# EasyEDA Pro project STM32空调遥控器.eprj, board PCB_V0.0.0
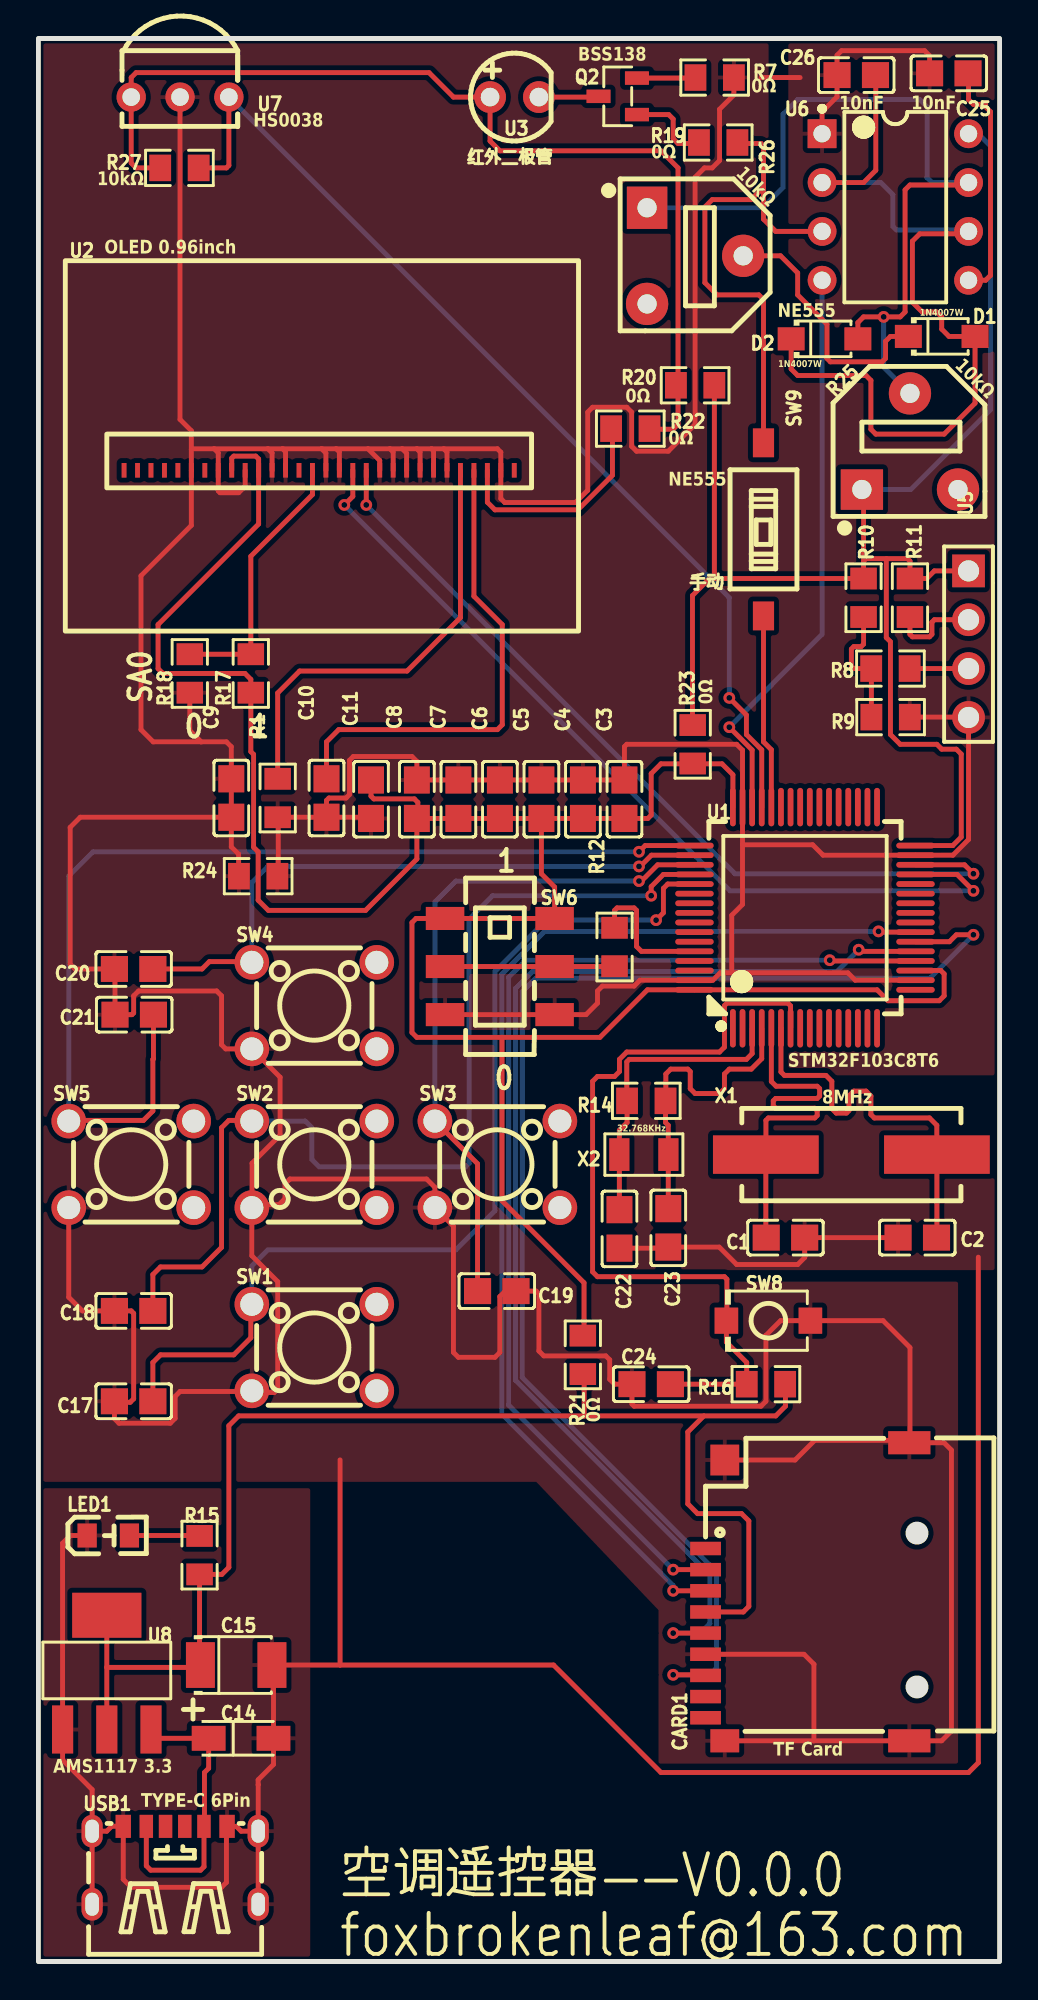
[diagram p1: board, top side]
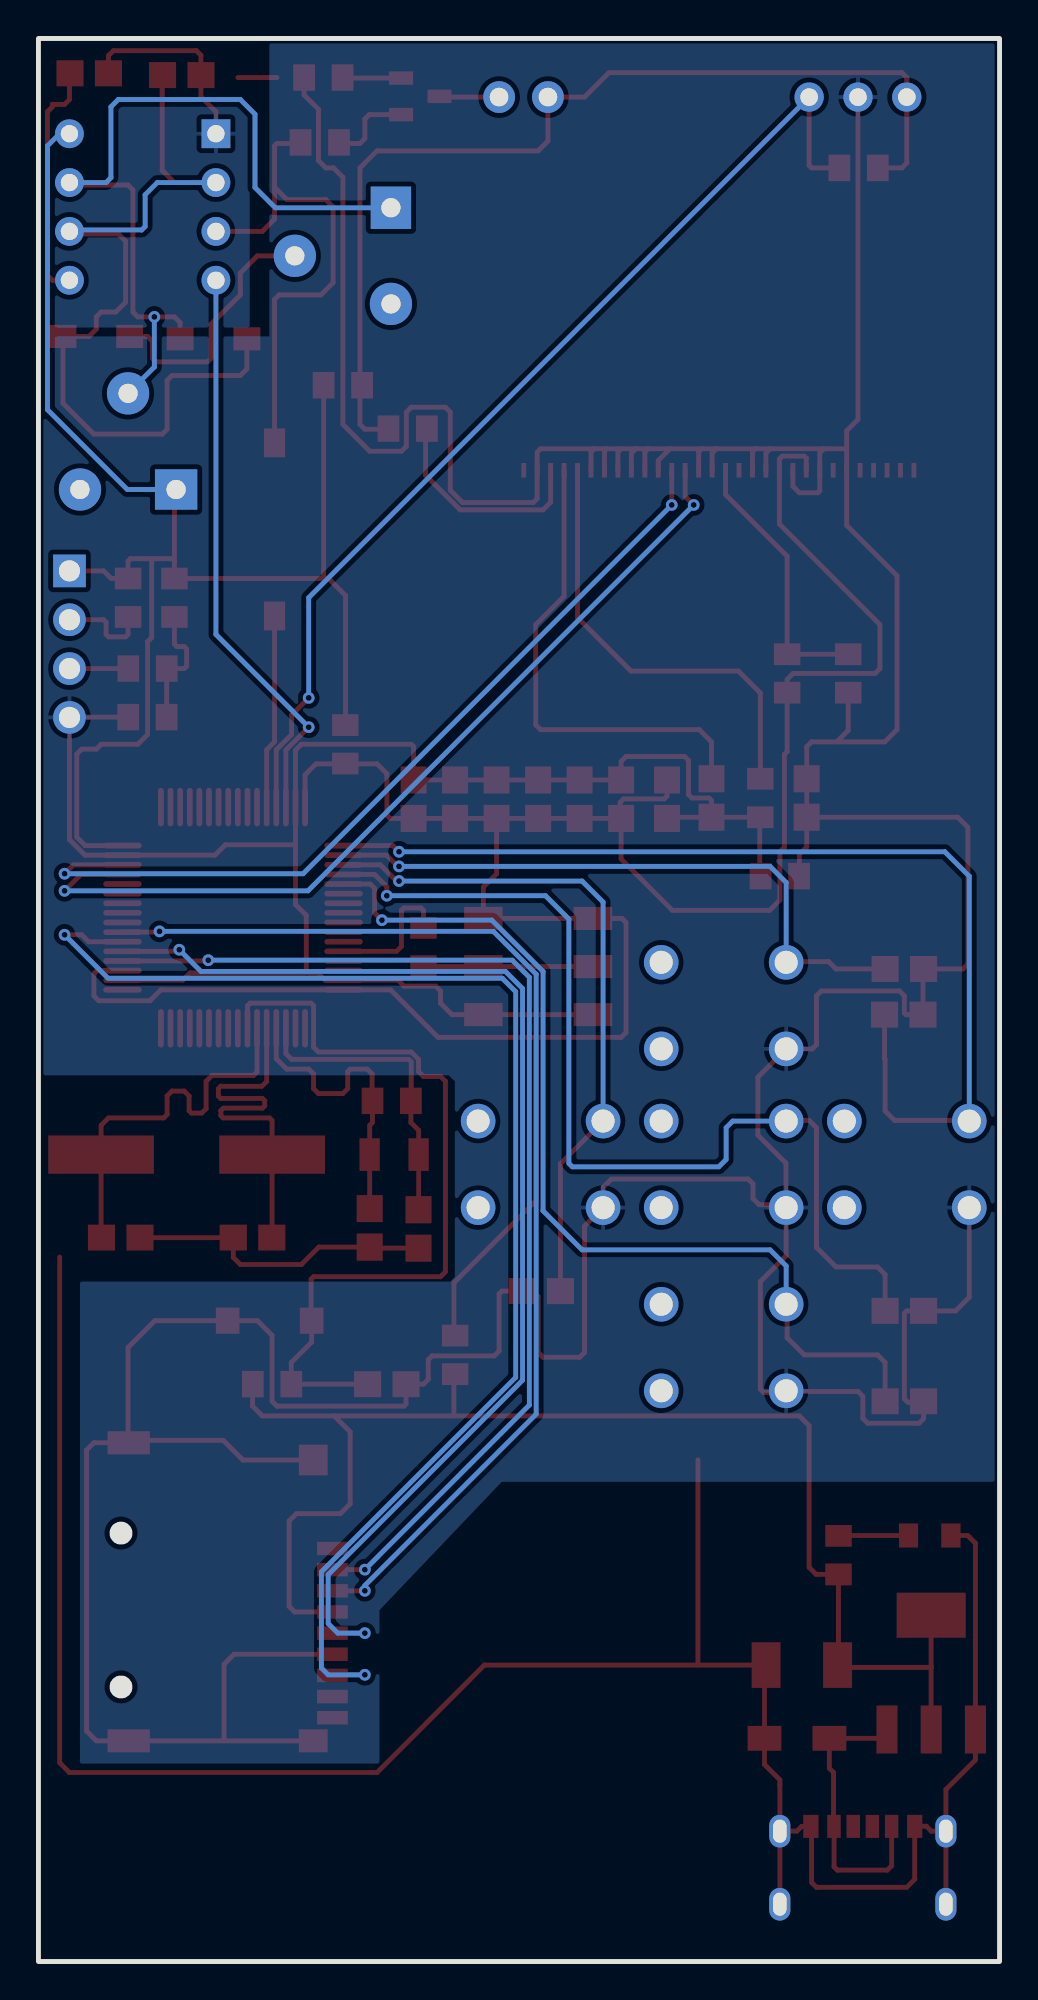
[diagram p2: board, bottom side, seen from below]

Outline 50 x 100 mm; copper layers: Top Layer, Bottom Layer. Coordinates in mm from the lower left corner of the outline.
Outline path: rectangle 0,100 50,0
Stack: Top Layer 0.035mm / Dielectric1 1.51mm FR4 er 4.5 / Bottom Layer 0.035mm

## Design rules (mm)
net OSC_IN: OSC
net OSC_OUT: OSC
net OSC32_IN: OSC32
net OSC32_OUT: OSC32
template: JLCPCB Capability(Two Layers Board)
spacing copperThickness1oz (default): track to track 0.102, other pairs 0.152 to 0.3
spacing copperThickness2oz: track to track 0.203, other pairs 0.152 to 0.3
track width copperThickness1oz (default): min 0.127, default 0.254, max 2.54
track width copperThickness2oz: min 0.203, default 0.254, max 2.54
differential pair differentialPair (default): width min 0.127, default 0.254, max 2.54; gap min 0.152, default 0.152
via viaSize (default): diameter min 0.5, default 0.61, max 10; hole min 0.3, default 0.305, max 6.3

## Placement (name value [footprint] x y rotation side)
C1  20pF  [C0805]  38.86 37.64 180 top
C2  20pF  [C0805]  45.72 37.64 0 top
C3  100nF  [C0805]  30.49 60.44 270 top
C4  100nF  [C0805]  28.33 60.44 270 top
C5  100nF  [C0805]  26.17 60.44 270 top
C6  100nF  [C0805]  24.01 60.44 270 top
C7  100nF  [C0805]  21.85 60.44 270 top
C8  4.7uF  [C0805]  19.69 60.44 270 top
C9  1uF  [C0805]  10.03 60.5 90 top
C10  2.2uF  [C0805]  14.99 60.5 270 top
C11  2.2uF  [C0805]  17.3 60.44 270 top
C14  10uF  [CAP-SMD_L3.2-W1.6-RD-C7171]  10.54 11.61 0 top
C15  22uF  [CASE-B_3528]  10.29 15.42 0 top
C17  100uF  [C0805]  4.95 29.13 0 top
C18  100uF  [C0805]  4.95 33.83 0 top
C19  100uF  [C0805]  23.84 34.86 180 top
C20  100uF  [C0805]  4.95 51.61 0 top
C21  100uF  [C0805]  4.98 49.24 0 top
C22  12.5pF  [C0805]  30.23 38.1 90 top
C23  12.5pF  [C0805]  32.77 38.15 90 top
C24  100nF  [C0805]  31.88 30.02 0 top
C25  0.01μF  [C0805]  47.36 98.19 0 top
C26  10nF  [C0805]  42.54 98.09 0 top
CARD1  TF PUSH  [TF-SMD_TF-PUSH]  40 19.23 90 top
D1  1N4007W  [SOD-123FL_L2.7-W1.8-LS3.8-RD]  46.99 84.51 0 top
D2  1N4007W  [SOD-123FL_L2.7-W1.8-LS3.8-RD]  40.89 84.38 0 top
LED1  -  [LED_0805]  3.68 22.15 0 top
Q2  BSS138  [SOT-23-3_L2.9-W1.3-P1.90-LS2.4-BR]  30.14 96.99 0 top
R1  64K  [R0805]  12.45 60.5 270 top
R7  165  [R0805]  35.18 97.97 180 top
R8  10K  [R0805]  44.32 67.23 180 top
R9  0  [R0805]  44.33 64.71 0 top
R10  0  [R0805]  42.93 70.92 90 top
R11  10K  [R0805]  45.34 70.92 90 top
R12  10K  [R0805]  29.97 52.76 270 top
R14  1M  [R0805]  31.62 44.75 180 top
R15  1.3K  [R0805]  8.38 21.13 270 top
R16  10K  [R0805]  37.85 30.02 0 top
R17  0  [R0805]  11.05 66.98 90 top
R18  0  [R0805]  7.87 66.98 90 top
R19  0  [R0805]  35.36 94.59 0 top
R20  0  [R0805]  34.16 81.97 0 top
R21  0  [R0805]  28.32 31.55 90 top
R22  0  [R0805]  30.79 79.71 0 top
R23  0  [R0805]  34.04 63.3 90 top
R24  0  [R0805]  11.43 56.44 0 top
R25  10kΩ  [RES-ADJ-SMD_RM065-V1]  45.34 79.05 0 top
R26  10kΩ  [RES-ADJ-SMD_RM065-V1]  34.16 88.7 270 top
R27  10K  [R0805]  7.33 93.27 180 top
SW1  KH-6X6X5H-TJ  [SW-TH_4P-L6.0-W6.0-P4.50-LS6.5]  14.35 31.93 0 top
SW2  KH-6X6X5H-TJ  [SW-TH_4P-L6.0-W6.0-P4.50-LS6.5]  14.35 41.45 0 top
SW3  KH-6X6X5H-TJ  [SW-TH_4P-L6.0-W6.0-P4.50-LS6.5]  23.88 41.45 0 top
SW4  KH-6X6X5H-TJ  [SW-TH_4P-L6.0-W6.0-P4.50-LS6.5]  14.35 49.71 0 top
SW5  KH-6X6X5H-TJ  [SW-TH_4P-L6.0-W6.0-P4.50-LS6.5]  4.83 41.45 0 top
SW6  MST22D18G2 125  [SW-SMD_MST22D18G2]  24 51.74 270 top
SW8  TS-1088-AR02016  [SW-SMD_L3.9-W3.0-P4.45]  37.97 33.33 180 top
SW9  DSIC01LS-P  [SW-SMD_2P-L3.5-W6.2-P2.54-LS9.8]  37.72 74.47 270 top
U1  STM32F103RCT6  [LQFP-64_L10.0-W10.0-P0.50-LS12.0-BL]  39.88 54.28 0 top
U2  -  [30pin_SSD1306]  1.4 88.44 0 top
U3  MHL312IR039CRT  [LED-TH_BD4.2-P2.54-FD]  24.76 96.95 0 top
U5  2.54-1*4  [HDR-TH_4P-P2.54-V-M-1]  48.39 68.5 270 top
U6  NE555N  [DIP-8_L9.8-W6.6-P2.54-LS7.6-BL]  44.58 91.24 270 top
U7  HS0038BD  [OPTO-TH_3P-L6.0-W5.6-P2.54_TSOP14656]  7.37 96.95 180 top
U8  AMS1117-3.3  [SOT-223-3_L6.5-W3.4-P2.30-LS7.0-BR]  3.56 15.04 270 top
USB1  TYPE-C 6P(073)  [TYPE-C-SMD_TYPE-C-6P_5]  7.11 5 0 top
X1  8MHz  [CRYSTAL-SMD_L11.5-W4.8-LS12.7]  42.29 41.96 0 top
X2  32.768kHz  [OSC-SMD_L3.2-W1.5]  31.5 41.96 180 top

## Footprints (pads in the part's own frame, mm; a bottom-side part is the same pattern mirrored in y, then rotated)
30pin_SSD1306
  custom 0.254x0.762 smd: 1(3.058,-10.899) 2(3.757,-10.899) 3(4.457,-10.899) 4(5.157,-10.899) 5(5.857,-10.899) 6(6.558,-10.899) 7(7.258,-10.899) 8(7.957,-10.899) 9(8.658,-10.899) 10(9.357,-10.899) 11(10.057,-10.899) 12(10.758,-10.899) 13(11.457,-10.899) 14(12.158,-10.899) 15(12.857,-10.899) 16(13.557,-10.899) 17(14.258,-10.899) 18(14.957,-10.899) 19(15.658,-10.899) 20(16.358,-10.899) 21(17.058,-10.899) 22(17.758,-10.899) 23(18.457,-10.899) 24(19.157,-10.899) 25(19.858,-10.899) 26(20.558,-10.899) 27(21.258,-10.899) 28(21.957,-10.899) 29(22.657,-10.899) 30(23.358,-10.899)
C0805
  rect 1.41x1.35 smd: 1(-1,0) 2(1,0)
CAP-SMD_L3.2-W1.6-RD-C7171
  rect 1.758x1.296 smd: 1(-1.687,0) 2(1.687,0)
CASE-B_3528
  rect 1.506x2.376 smd: 1(-1.861,0) 2(1.861,0)
CRYSTAL-SMD_L11.5-W4.8-LS12.7
  rect 5.5x2 smd: 1(-4.45,0) 2(4.45,0)
DIP-8_L9.8-W6.6-P2.54-LS7.6-BL
  rect 1.5x1.5 hole 0.9: 1(-3.81,-3.81)
  round 1.5 hole 0.9: 2(-1.27,-3.81) 3(1.27,-3.81) 4(3.81,-3.81) 5(3.81,3.81) 6(1.27,3.81) 7(-1.27,3.81) 8(-3.81,3.81)
HDR-TH_4P-P2.54-V-M-1
  rect 1.7x1.7 hole 1.1: 1(-3.81,0)
  round 1.7 hole 1.1: 2(-1.27,0) 3(1.27,0) 4(3.81,0)
LED-TH_BD4.2-P2.54-FD
  round 1.651 hole 0.965: 1(-1.27,0) 2(1.27,0)
LED_0805
  rect 1x1.25 smd: 1(-1.15,0.005) 2(1.05,0.005)
LQFP-64_L10.0-W10.0-P0.50-LS12.0-BL
  oval 0.3x2 smd: 1(-3.75,-5.75) 2(-3.25,-5.75) 3(-2.75,-5.75) 4(-2.25,-5.75) 5(-1.75,-5.75) 6(-1.25,-5.75) 7(-0.75,-5.75) 8(-0.25,-5.75) 9(0.25,-5.75) 10(0.75,-5.75) 11(1.25,-5.75) 12(1.75,-5.75) 13(2.25,-5.75) 14(2.75,-5.75) 15(3.25,-5.75) 16(3.75,-5.75) 33(3.75,5.75) 34(3.25,5.75) 35(2.75,5.75) 36(2.25,5.75) 37(1.75,5.75) 38(1.25,5.75) 39(0.75,5.75) 40(0.25,5.75) 41(-0.25,5.75) 42(-0.75,5.75) 43(-1.25,5.75) 44(-1.75,5.75) 45(-2.25,5.75) 46(-2.75,5.75) 47(-3.25,5.75) 48(-3.75,5.75)
  oval 2x0.3 smd: 17(5.75,-3.75) 18(5.75,-3.25) 19(5.75,-2.75) 20(5.75,-2.25) 21(5.75,-1.75) 22(5.75,-1.25) 23(5.75,-0.75) 24(5.75,-0.25) 25(5.75,0.25) 26(5.75,0.75) 27(5.75,1.25) 28(5.75,1.75) 29(5.75,2.25) 30(5.75,2.75) 31(5.75,3.25) 32(5.75,3.75) 49(-5.75,3.75) 50(-5.75,3.25) 51(-5.75,2.75) 52(-5.75,2.25) 53(-5.75,1.75) 54(-5.75,1.25) 55(-5.75,0.75) 56(-5.75,0.25) 57(-5.75,-0.25) 58(-5.75,-0.75) 59(-5.75,-1.25) 60(-5.75,-1.75) 61(-5.75,-2.25) 62(-5.75,-2.75) 63(-5.75,-3.25) 64(-5.75,-3.75)
OPTO-TH_3P-L6.0-W5.6-P2.54_TSOP14656
  round 1.524 hole 0.914: 1(-2.54,0) 2(0,0) 3(2.54,0)
OSC-SMD_L3.2-W1.5
  rect 1.05x1.7 smd: 1(-1.275,0) 2(1.275,0)
R0805
  rect 1.133x1.377 smd: 1(-1,0) 2(1,0)
RES-ADJ-SMD_RM065-V1
  rect 2.2x2.1 hole 1: 1(-2.5,-2.5)
  round 2.2 hole 1: 2(0,2.5) 3(2.5,-2.5)
SOD-123FL_L2.7-W1.8-LS3.8-RD
  rect 1.4x1.2 smd: 1(-1.735,0) 2(1.735,0)
SOT-23-3_L2.9-W1.3-P1.90-LS2.4-BR
  rect 1.25x0.7 smd: 1(1,-0.95) 2(1,0.95) 3(-1,0)
SOT-223-3_L6.5-W3.4-P2.30-LS7.0-BR
  rect 2.5x1.1 smd: 1(2.97,-2.3) 2(2.97,0) 3(2.97,2.3)
  rect 2.34x3.6 smd: 4(-2.97,0)
SW-SMD_2P-L3.5-W6.2-P2.54-LS9.8
  rect 1.5x1.1 smd: 1(-4.5,0) 2(4.5,0)
SW-SMD_L3.9-W3.0-P4.45
  rect 1.23x1.36 smd: 1(-2.185,0) 2(2.185,0)
SW-SMD_MST22D18G2
  rect 1.2x2 smd: 1(-2.5,2.85) 2(0,2.85) 3(2.5,2.85) 4(-2.5,-2.85) 5(0,-2.85) 6(2.5,-2.85)
SW-TH_4P-L6.0-W6.0-P4.50-LS6.5
  round 1.8 hole 1.2: 1(-3.25,2.25) 2(3.25,2.25) 3(-3.25,-2.25) 4(3.25,-2.25)
TF-SMD_TF-PUSH
  rect 0.7x1.6 smd: 1(2.25,5.3) 2(1.15,5.3) 3(0.05,5.3) 4(-1.05,5.3) 5(-2.15,5.3) 6(-3.25,5.3) 7(-4.35,5.3) 8(-5.45,5.3) CD(-6.55,5.3)
  rect 1.2x1.5 smd: 10(-7.75,4.3)
  rect 1.2x2.2 smd: 11(-7.75,-5.3) 12(7.75,-5.3)
  rect 1.6x1.5 smd: 13(6.85,4.3)
TYPE-C-SMD_TYPE-C-6P_5
  oval 1.1x1.7 hole 0.7x1.2: 7(-4.32,1.775) 7(-4.32,-2.025) 7(4.32,1.775) 7(4.32,-2.025)
  rect 0.7x1.2 smd: A5(-0.5,2.025) A9(1.5,2.025) B5(0.5,2.025) B9(-1.5,2.025)
  rect 0.8x1.2 smd: A12(2.7,2.025) B12(-2.7,2.025)

## Nets
+5V: C14.1 U8.3 USB1.A9 USB1.B9
GND: C1.1 C2.1 C3.1 C4.1 C5.1 C6.1 C7.1 C8.1 C9.1 C9.2 C10.2 C11.2 C14.2 C15.2 C17.1 C18.1 C19.1 C20.1 C21.1 C22.1 C23.1 C24.1 C25.1 C26.1 CARD1.6 CARD1.10 CARD1.11 CARD1.12 CARD1.13 LED1.1 R1.2 R7.1 R9.2 R18.1 R24.1 R24.2 SW1.3 SW2.3 SW3.3 SW4.3 SW5.3 SW6.3 SW6.6 SW8.1 U1.18 U1.31 U1.47 U1.63 U2.6 U2.8 U2.10 U2.12 U2.13 U2.16 U2.17 U2.20 U2.21 U2.22 U2.23 U2.24 U2.25 U2.29 U5.4 U6.1 U7.2 U8.1 USB1.7 USB1.A12 USB1.B12
VCC: C3.2 C4.2 C5.2 C6.2 C7.2 C8.2 C11.1 C15.1 CARD1.4 R10.2 R11.2 R15.2 R16.2 R17.1 R20.1 R20.2 R21.1 R21.2 R22.1 R22.2 R23.1 R23.2 R25.1 R27.2 SW6.1 SW6.4 U1.19 U1.32 U1.48 U1.64 U2.9 U2.11 U2.28 U3.1 U5.1 U6.8 U7.3 U8.2 U8.4
BOOT0: R12.1 U1.60
IR_CTL: U1.46 U6.4
IR_IN: R27.1 U1.45 U7.1
IR_OUT: Q2.1 R19.1 R19.2 SW9.1 U6.3
KEY_1: C17.2 SW1.1 U1.53
KEY_2: C18.2 SW2.1 U1.52
KEY_3: C19.2 SW3.1 U1.51
KEY_4: C20.2 SW4.1 U1.50
KEY_5: C21.2 SW5.1 U1.49
NRST: C24.2 R16.1 SW8.2 U1.7
OLED_SCL: U1.29 U2.18
OLED_SDA: U1.30 U2.19
OSC32_IN: C22.2 R14.2 U1.3 X2.2
OSC32_OUT: C23.2 R14.1 U1.4 X2.1
OSC_IN: C1.2 U1.5 X1.1
OSC_OUT: C2.2 U1.6 X1.2
SPI_CLK: CARD1.5 U1.21
SPI_CS: CARD1.2 U1.20
SPI_DI: CARD1.3 U1.23
SPI_DO: CARD1.7 U1.22
SWCLK: R8.1 U5.3
SWDIO: R11.1 U5.2
$1N1778: R1.1 U2.26
$1N2024: C10.1 U2.27
$1N5193: Q2.3 U3.2
$1N5313: Q2.2 R7.2
$1N5687: R8.2 R9.1 R10.1
$1N5950: R12.2 SW6.2 SW6.5
$1N6331: LED1.2 R15.1
$1N7000: R17.2 R18.2 U2.15
$1N7313: SW9.2 U1.44
$1N7750: C25.2 U6.5
$1N7809: C26.2 D1.2 D2.1 U6.2 U6.6
$1N7888: D2.2 R25.2 R26.1 U6.7
$1N9996: D1.1 R26.2

Pads without a net: CARD1 1 8 CD; R25 3; R26 3; SW1 2 4; SW2 2 4; SW3 2 4; SW4 2 4; SW5 2 4; U1 1 2 8 9 10 11 12 13 14 15 16 17 24 25 26 27 28 33 34 35 36 37 38 39 40 41 42 43 54 55 56 57 58 59 61 62; U2 1 2 3 4 5 7 14 30; USB1 A5 B5

## Via types
v1: diameter 0.61, hole 0.305, Top Layer to Bottom Layer, 20 vias

## Routing (per net, layer and track width the routed paths; a pad name or vN(x,y) marks a point on that pad's centre or on a via; arc(x,y) is an arc through that point)
+5V: length 15.2
  Top Layer w0.254: U8.3 6.31,11.61 C14.1 8.85,10.05 8.64,9.83 8.64,7.05 USB1.A9 8.61,4.93 8.43,4.75 5.84,4.75 5.61,4.98 USB1.B9
GND: length 554.8
  Top Layer w0.254: 11.06,29.64 11.12,29.59 12.27,29.59 12.45,29.77 12.45,35.36 11.1,36.7 SW2.3 11.11,39.21 11.11,39.36 ; 11.06,29.64 SW1.3 ; 11.06,29.64 7.37,29.64 7.11,29.39 7.11,28.25 6.86,27.99 4.19,27.99 3.95,28.23 C17.1 4.01,29.08 4.77,29.08 4.95,29.26 4.95,33.71 4.83,33.83 C18.1 2.29,33.83 1.58,34.54 SW5.3 ; CARD1.12 45.34,27.01 45.34,31.93 43.94,33.33 SW8.1 38.61,33.33 37.85,32.56 37.85,29.13 37.59,28.88 30.99,28.88 30.88,28.99 C24.1 29.97,30.02 29.72,30.28 29.72,31.29 29.52,31.49 26.29,31.49 26.03,31.75 26.03,34.72 25.89,34.86 C19.1 24.28,34.86 24,34.58 24,31.67 23.75,31.42 21.84,31.42 21.59,31.67 21.59,38.24 SW3.3 20.63,40.26 20.19,40.69 13.08,40.69 12.83,40.44 12.83,39.67 12.51,39.36 11.11,39.36 ; CARD1.12 47.11,26.98 47.5,26.59 47.5,11.99 46.99,11.48 CARD1.11 40.34,11.48 ; CARD1.12 45.18,27.1 40.39,27.1 39.36,26.08 CARD1.13 ; 18.92,78.66 19.15,78.43 U2.22 ; 18.92,78.66 19.69,78.66 ; 18.92,78.66 18.29,78.66 ; 11.11,39.36 11.11,41.52 12.57,42.98 12.57,45.99 SW4.3 9.74,47.46 9.53,47.68 9.53,50.22 9.27,50.47 5.21,50.47 4.95,50.22 4.95,49.33 4.86,49.24 C21.1 3.98,51.58 C20.1 1.91,51.61 1.65,51.87 1.65,58.98 2.17,59.5 C9.1 ; 17.15,78.66 15.49,78.66 ; 17.15,78.66 17.75,78.05 U2.20 ; 17.15,78.66 18.29,78.66 ; 15.49,78.66 14.73,78.66 ; 15.49,78.66 15.65,78.5 U2.17 ; 36.07,51.43 36.07,54.41 36.63,54.97 36.63,58.07 ; 18.29,78.66 18.45,78.5 U2.21 ; 37.59,97.97 39.62,97.97 ; U2.23 19.85,78.49 19.69,78.66 ; 21.08,78.66 23.88,78.66 24.05,78.49 U2.29 24.05,76.07 24.26,75.87 27.94,75.87 28.57,76.5 28.57,80.57 28.83,80.82 30.61,80.82 30.86,80.57 30.86,78.79 31.12,78.54 32.77,78.54 34.16,79.93 34.16,92.79 34.65,93.27 35.05,93.27 35.43,93.65 35.43,96.32 36.18,97.06 R7.1 ; 21.08,78.66 21.25,78.49 U2.25 ; 21.08,78.66 20.45,78.66 ; R18.1 7.87,64.01 8.46,63.42 ; 14.73,78.66 12.7,78.66 ; 14.73,78.66 14.95,78.44 U2.16 ; 12.7,78.66 12.85,78.51 U2.13 ; 12.7,78.66 11.94,78.66 ; 19.69,78.66 20.45,78.66 ; C9.1 10.03,57.96 10.41,57.58 10.41,56.45 10.47,56.39 ; C9.1 C9.2 10.03,63.17 9.78,63.42 8.46,63.42 ; 7.95,78.62 U2.6 7.95,74.68 5.33,72.06 5.33,64.06 5.97,63.42 8.46,63.42 ; 7.95,78.62 7.95,79.6 7.37,80.19 U7.2 ; 7.95,78.62 7.99,78.66 9.14,78.66 ; 40.34,11.48 40.34,15.46 39.83,15.98 CARD1.6 ; 40.34,11.48 CARD1.10 ; C10.2 17.27,59.5 17.3,59.48 ; C10.2 R1.2 12.47,59.47 12.47,56.39 ; C10.2 14.99,60.38 15.11,60.5 16,60.5 16.18,60.68 16.18,62.46 16.38,62.66 19.43,62.66 19.69,62.41 C8.1 C7.1 C6.1 C5.1 C4.1 C3.1 30.49,63.17 30.61,63.3 36.32,63.3 36.63,62.99 U1.47 36.63,58.07 ; 20.45,78.66 20.55,78.56 U2.24 ; C22.1 32.71,37.1 C23.1 35.42,37.15 36.32,36.25 39.5,36.25 39.86,36.61 C1.1 C2.1 ; 11.43,2.98 USB1.7 ; USB1.7 10.54,6.78 10.29,7.03 USB1.A12 9.78,7 9.78,4.12 9.53,3.86 4.83,3.86 4.41,4.28 USB1.B12 4.41,7.04 3.81,7.04 3.55,6.78 USB1.7 ; USB1.7 11.43,9.19 11.43,9.19 11.43,9.45 12.23,10.25 C14.2 12.23,15.34 C15.2 15.69,15.42 ; USB1.7 2.79,2.98 ; USB1.7 2.79,6.78 2.79,8.94 1.26,10.48 U8.1 1.26,21.75 1.66,22.15 LED1.1 ; R9.2 48.37,64.71 U5.4 48.39,58.34 47.57,57.53 U1.31 40.82,57.53 40.28,58.07 36.63,58.07 ; 11.94,78.66 9.14,78.66 ; 11.94,78.66 12.15,78.45 U2.12 ; 9.14,78.66 9.35,78.45 U2.8 9.35,76.47 9.45,76.38 10.41,76.38 10.75,76.72 U2.10 ; 36.09,51.41 42.11,51.41 42.49,51.03 U1.18 ; C25.1 46.36,99.11 46.1,99.37 41.78,99.37 41.54,99.13 C26.1 41.54,96.97 40.77,96.19 U6.1 ; 48.9,36.63 48.9,10.34 48.39,9.83 32.38,9.83 26.8,15.42 15.69,15.42 ; SW6.6 SW6.3 28.49,49.24 29.08,49.83 29.08,50.47 29.34,50.72 30.99,50.72 31.29,51.03 U1.63 35.09,51.03 35.47,51.41 36.02,51.41 ; 15.69,15.42 15.69,26.09
VCC: length 354.6
  Top Layer w0.254: 28.39,28.37 28.39,30.49 28.38,30.49 ; 28.39,28.37 34.61,28.37 ; 28.39,28.37 10.41,28.37 9.91,27.86 9.91,20.5 9.54,20.13 R15.2 8.38,15.46 C15.1 8.3,15.29 3.56,15.29 ; R25.1 42.93,76.46 42.93,72.82 ; R27.2 5.08,93.27 4.83,93.52 U7.3 4.83,97.97 5.08,98.22 20.32,98.22 21.59,96.95 23.5,96.95 23.5,94.67 24,94.16 32.38,94.16 33.27,93.27 33.27,79.93 33.02,79.68 31.86,79.68 ; U1.32 47.56,58.03 48.01,58.47 48.01,62.79 47.75,63.04 46.99,63.04 46.74,63.3 44.83,63.3 44.32,63.81 44.32,68.63 44.11,68.84 44.11,72.95 ; 34.61,28.37 33.78,27.54 33.78,23.8 34.29,23.29 36.58,23.29 36.96,22.91 36.96,18.47 36.67,18.18 CARD1.4 ; 34.61,28.37 38.35,28.37 38.86,28.88 38.86,30.01 R16.2 ; U1.48 36.13,61.71 35.56,62.28 32.38,62.28 31.88,61.77 31.88,59.61 31.7,59.44 C3.2 C4.2 C5.2 ; U5.1 46.61,72.31 46.21,71.92 R11.2 45.34,72.82 45.21,72.95 44.11,72.95 ; U1.19 45.64,51.54 46.94,51.54 47.12,51.36 47.12,50.22 46.86,49.96 44.2,49.96 43.63,50.53 U1.64 31.68,50.53 29.21,48.06 24.12,48.06 ; C8.2 C7.2 C6.2 C5.2 ; C8.2 19.74,59.49 19.74,60.28 19.56,60.46 17.44,60.46 17.3,60.6 17.3,61.48 ; C8.2 19.69,57.33 17.02,54.66 11.96,54.66 11.43,55.19 11.43,57.71 11.19,57.95 11.19,62.77 11.05,62.92 R17.1 11.05,66.67 10.74,66.98 6.48,66.98 6.22,67.23 6.22,69.52 11.45,74.75 U2.11 11.45,78.13 11.3,78.28 10.16,78.28 10.05,78.18 U2.9 ; 29.86,79.68 29.86,77.29 28.06,75.49 23.75,75.49 23.35,75.88 U2.28 ; 3.56,15.29 U8.2 ; 3.56,15.29 U8.4 ; 24.12,48.06 24.12,39.56 28.38,35.3 28.38,32.49 ; 24.12,48.06 19.69,48.06 19.43,48.31 19.43,54.03 19.65,54.24 SW6.4 SW6.1 26.85,55.88 26.17,56.56 C5.2 ; 42.93,72.82 R10.2 35.16,71.92 ; 42.93,72.82 43.05,72.95 44.11,72.95 ; R20.2 35.16,71.92 35.16,71.92 ; 34.03,64.3 34.03,71.03 34.91,71.92 35.16,71.92
  Bottom Layer w0.254: R25.1 45.38,76.55 49.53,80.7 49.53,94.41 48.9,95.05 U6.8
BOOT0: length 7.1
  Top Layer w0.254: U1.60 31.37,52.53 31.12,52.78 31.12,54.66 30.99,54.79 30.1,54.79 29.97,54.66 R12.1
IR_CTL: length 29.9
  Top Layer w0.254: v1(35.94,64.19) 37.13,63 U1.46
  Bottom Layer w0.254: 40.77,87.43 40.77,69.01 v1(35.94,64.19)
IR_IN: length 53.6
  Top Layer w0.254: R27.1 9.78,93.27 9.91,93.4 U7.1 ; v1(35.94,65.71) 36.83,64.82 36.83,63.81 37.63,63.01 U1.45
  Bottom Layer w0.254: U7.1 35.94,70.92 v1(35.94,65.71)
IR_OUT: length 31.2
  Top Layer w0.254: SW9.1 37.72,86.42 37.48,86.67 35.31,86.67 34.67,87.3 34.67,91.24 35.05,91.62 37.07,91.62 37.72,92.26 ; 34.31,94.54 33.27,94.54 33.02,94.79 33.02,95.81 32.79,96.04 Q2.1 ; 37.72,92.26 37.72,94.41 37.59,94.54 36.31,94.54 ; 37.72,92.26 37.72,90.6 38.35,89.97 U6.3
KEY_1: length 50.7
  Top Layer w0.254: v1(32.13,54.15) 32.51,54.53 32.51,55.8 32.74,56.03 U1.53 ; C17.2 5.95,31.15 6.35,31.55 10.16,31.55 11.05,32.44 11.05,34.13 SW1.1
  Bottom Layer w0.254: v1(32.13,54.15) 26.42,54.15 23.75,51.49 23.75,39.04 21.72,37.01 11.94,37.01 11.1,36.17 SW1.1
KEY_2: length 53
  Top Layer w0.254: SW2.1 11.06,43.74 9.91,43.74 9.53,43.36 9.53,37.14 8.51,36.12 6.35,36.12 5.95,35.72 C18.2 ; v1(31.88,55.42) 31.88,55.89 32.51,56.53 U1.52
  Bottom Layer w0.254: SW2.1 13.88,43.7 14.22,43.36 14.22,41.71 14.6,41.33 22.22,41.33 22.4,41.51 22.4,54.21 23.62,55.42 v1(31.88,55.42)
KEY_3: length 35.5
  Top Layer w0.254: v1(31.24,56.19) 31.37,56.19 32.21,57.03 U1.51 ; C19.2 22.84,41.48 SW3.1
  Bottom Layer w0.254: SW3.1 20.63,55.09 21.72,56.19 v1(31.24,56.19)
KEY_4: length 33.1
  Top Layer w0.254: C20.2 8.51,51.61 8.89,51.99 11.06,51.99 SW4.1 ; U1.50 31.89,57.53 31.31,56.95 v1(31.24,56.95)
  Bottom Layer w0.254: v1(31.24,56.95) 11.94,56.95 11.1,56.11 SW4.1
KEY_5: length 55.6
  Top Layer w0.254: U1.49 31.56,58.03 v1(31.24,57.71) ; C21.2 5.98,46.94 5.95,46.91 5.95,44.23 5.46,43.74 1.61,43.74 SW5.1
  Bottom Layer w0.254: v1(31.24,57.71) 2.85,57.71 1.58,56.44 SW5.1
NRST: length 41.8
  Top Layer w0.254: U1.7 39.13,49.7 38.99,49.83 35.81,49.83 35.69,49.71 35.69,47.55 35.43,47.3 30.61,47.3 30.23,46.91 30.23,46.28 29.97,46.03 29.08,46.03 28.83,45.77 28.83,35.86 29.08,35.61 35.69,35.61 35.81,35.48 35.81,33.35 SW8.2 35.79,32.21 36.85,31.15 R16.1 C24.2
OLED_SCL: length 46.4
  Top Layer w0.254: U2.18 16.35,76.19 v1(15.91,75.74) ; v1(48.64,55.68) 47.79,56.53 U1.29
  Bottom Layer w0.254: v1(48.64,55.68) 35.98,55.68 v1(15.91,75.74)
OLED_SDA: length 44.5
  Top Layer w0.254: U1.30 48.18,57.03 v1(48.64,56.57) ; U2.19 v1(17.05,75.74)
  Bottom Layer w0.254: v1(17.05,75.74) 36.23,56.57 v1(48.64,56.57)
OSC32_IN: length 15.9
  Top Layer w0.254: C22.2 30.22,39.1 X2.2 30.22,43.23 30.62,43.63 R14.2 30.61,44.77 30.61,46.79 30.73,46.91 36.83,46.91 37.13,47.21 U1.3
OSC32_OUT: length 16
  Top Layer w0.254: C23.2 32.77,41.96 X2.1 32.77,41.97 32.77,43.48 32.62,43.63 R14.1 32.64,44.77 32.64,46.15 32.89,46.41 33.78,46.41 33.91,46.28 33.91,45.39 34.16,45.14 35.43,45.14 35.69,45.39 35.69,46.15 35.94,46.41 37.08,46.41 37.63,46.95 U1.4
OSC_IN: length 20.1
  Top Layer w0.254: C1.2 37.84,37.66 X1.1 37.85,41.97 37.85,43.74 37.97,43.87 40.39,43.87 40.51,43.99 40.51,44.25 40.39,44.37 38.35,44.37 38.23,44.5 38.23,44.75 38.35,44.88 40.51,44.88 40.64,45.01 40.64,45.39 40.51,45.52 38.38,45.52 38.13,45.76 U1.5
OSC_OUT: length 20.2
  Top Layer w0.254: U1.6 38.63,46.26 38.81,46.08 40.97,46.08 41.28,45.77 41.28,44.35 41.5,44.12 42.04,44.12 42.16,44.25 42.16,45.01 42.42,45.26 43.05,45.26 43.31,45.01 43.31,44.05 43.49,43.87 46.35,43.87 46.74,43.48 46.74,41.97 X1.2 46.74,37.66 C2.2
SPI_CLK: length 62.7
  Top Layer w0.254: CARD1.5 v1(33.02,17.08) ; v1(42.67,52.61) 42.76,52.53 U1.21
  Bottom Layer w0.254: v1(42.67,52.61) 41.54,51.49 25.71,51.49 24.82,50.6 24.82,30.22 34.93,20.12 34.93,17.58 34.43,17.08 v1(33.02,17.08)
SPI_CS: length 57.6
  Top Layer w0.254: U1.20 41.21,52.03 v1(41.16,52.07) ; CARD1.2 v1(33.02,20.38)
  Bottom Layer w0.254: v1(41.16,52.07) 25.35,52.07 24.46,51.18 24.46,28.94 v1(33.02,20.38)
SPI_DI: length 59.9
  Top Layer w0.254: CARD1.3 v1(33.02,19.28) ; v1(43.7,53.57) 43.74,53.53 U1.23
  Bottom Layer w0.254: v1(33.02,19.28) 33.02,19.55 24.1,28.47 24.1,51.34 26.34,53.57 v1(43.7,53.57)
SPI_DO: length 71.3
  Top Layer w0.254: CARD1.7 34.67,14.91 v1(33.02,14.91) ; v1(48.64,53.39) 47.75,53.39 47.39,53.03 U1.22
  Bottom Layer w0.254: v1(48.64,53.39) 46.38,51.13 25.87,51.13 25.17,50.44 25.17,30.37 35.28,20.26 35.28,15.27 34.93,14.91 v1(33.02,14.91)
SWCLK: length 3.1
  Top Layer w0.254: R8.1 U5.3
SWDIO: length 4.7
  Top Layer w0.254: R11.1 45.34,69.01 45.47,68.89 46.35,68.89 46.48,69.01 46.48,69.65 46.61,69.77 U5.2
$1N1778: length 23.3
  Top Layer w0.254: U2.26 21.95,69.88 19.18,67.11 13.59,67.11 12.45,65.96 R1.1
$1N2024: length 25.3
  Top Layer w0.254: U2.27 22.65,71 24.13,69.52 24.13,64.31 23.88,64.06 15.62,64.06 14.99,63.42 C10.1
$1N5193: length 3.1
  Top Layer w0.254: Q2.3 29.1,96.95 U3.2
$1N5313: length 3.1
  Top Layer w0.254: Q2.2 34.15,97.94 R7.2
$1N5687: length 6.7
  Top Layer w0.254: R10.1 42.93,68.5 42.8,68.38 42.42,68.38 42.29,68.25 42.29,67.36 42.42,67.23 R8.2 43.33,67.23 R9.1
$1N5950: length 8.8
  Top Layer w0.254: R12.2 29.96,51.74 SW6.2 SW6.5
$1N6331: length 3.7
  Top Layer w0.254: R15.1 8.36,22.15 LED1.2
$1N7000: length 14.1
  Top Layer w0.254: U2.15 14.25,76.28 11.05,73.08 R17.2 R18.2
$1N7313: length 10.1
  Top Layer w0.254: U1.44 38.13,63.02 37.72,63.42 SW9.2
$1N7750: length 12.6
  Top Layer w0.254: C25.2 48.39,98.16 48.39,96.83 48.64,96.57 49.28,96.57 49.28,96.44 49.53,96.19 49.53,87.68 49.28,87.43 48.39,87.43
$1N7809: length 46.5
  Top Layer w0.254: U6.6 48.26,89.84 45.85,89.84 45.47,89.46 45.47,86.28 45.97,85.78 46.74,85.78 46.99,85.52 46.99,84.89 47.37,84.51 48.72,84.51 48.72,81.03 47.12,79.43 43.56,79.43 43.31,79.68 43.31,82.22 43.05,82.47 39.5,82.47 39.16,82.81 D2.1 ; 40.77,92.51 42.93,92.51 43.56,93.14 43.56,98.08 C26.2
  Bottom Layer w0.254: 40.77,92.51 43.81,92.51 44.45,91.87 44.45,90.22 44.63,90.04 48.31,90.04 U6.6
$1N7888: length 43.1
  Top Layer w0.254: 42.63,84.38 42.63,85.22 42.93,85.52 v1(43.97,85.52) 44.83,85.52 45.09,85.78 45.09,92.13 45.34,92.38 48.26,92.38 48.39,92.51
  Bottom Layer w0.254: R25.2 43.97,82.91 v1(43.97,85.52) ; 48.39,92.51 46.48,92.51 46.23,92.76 46.23,96.44 45.85,96.83 39.5,96.83 38.74,96.06 38.74,92.25 37.68,91.2 R26.1
$1N9996: length 13.7
  Top Layer w0.254: R26.2 38.61,88.7 39.5,87.81 39.5,86.67 41.02,85.14 41.02,83.36 41.2,83.18 43.89,83.18 44.07,83.36 44.07,84.25 44.32,84.51 D1.1

## Copper pours and planes (outline as drawn; the poured copper is in the pictures)
GND on Top Layer: 0,24.61 14.14,24.61 14.14,0 0,0
GND on Top Layer: 39.01,100 50,100 50,84.97 39.01,84.97
GND on Top Layer: 29.08,45.77 50,45.77 50,35.96 29.08,35.96
GND on Top Layer: 50,84.44 49.75,46.09 28.65,46.09 28.34,45.77 28.34,35.59 28.57,35.36 47.84,35.36 47.84,10.29 32.3,10.29 32.26,10.34 32.26,18.28 25.9,24.94 -0.25,24.94 -0.25,99.97 -0.22,100 37.99,100 37.99,84.52 37.97,84.51 49.94,84.51
GND on Bottom Layer: 50,84.44 49.75,46.09 28.65,46.09 28.34,45.77 28.34,35.59 28.57,35.36 47.84,35.36 47.84,10.29 32.3,10.29 32.26,10.34 32.26,18.28 25.9,24.94 -0.25,24.94 -0.25,99.97 -0.22,100 37.99,100 37.99,84.52 37.97,84.51 49.94,84.51
GND on Bottom Layer: 39.01,100 50,100 50,84.97 39.01,84.97

## Text on the board
Top Silkscreen Layer: 0 | 1 | SA0 | foxbrokenleaf@163.com | 32.768KHz | 1N4007W | AMS1117 3.3 | OLED 0.96inch | TYPE-C 6Pin | HS0038 | 红外二极管 | BSS138 | 0Ω | NE555 | 手动 | TF Card | STM32F103C8T6 | 8MHz | 10nF | 10kΩ | 空调遥控器——V0.0.0
